# Altium schematic sheet Sensors.SchDoc
size A4
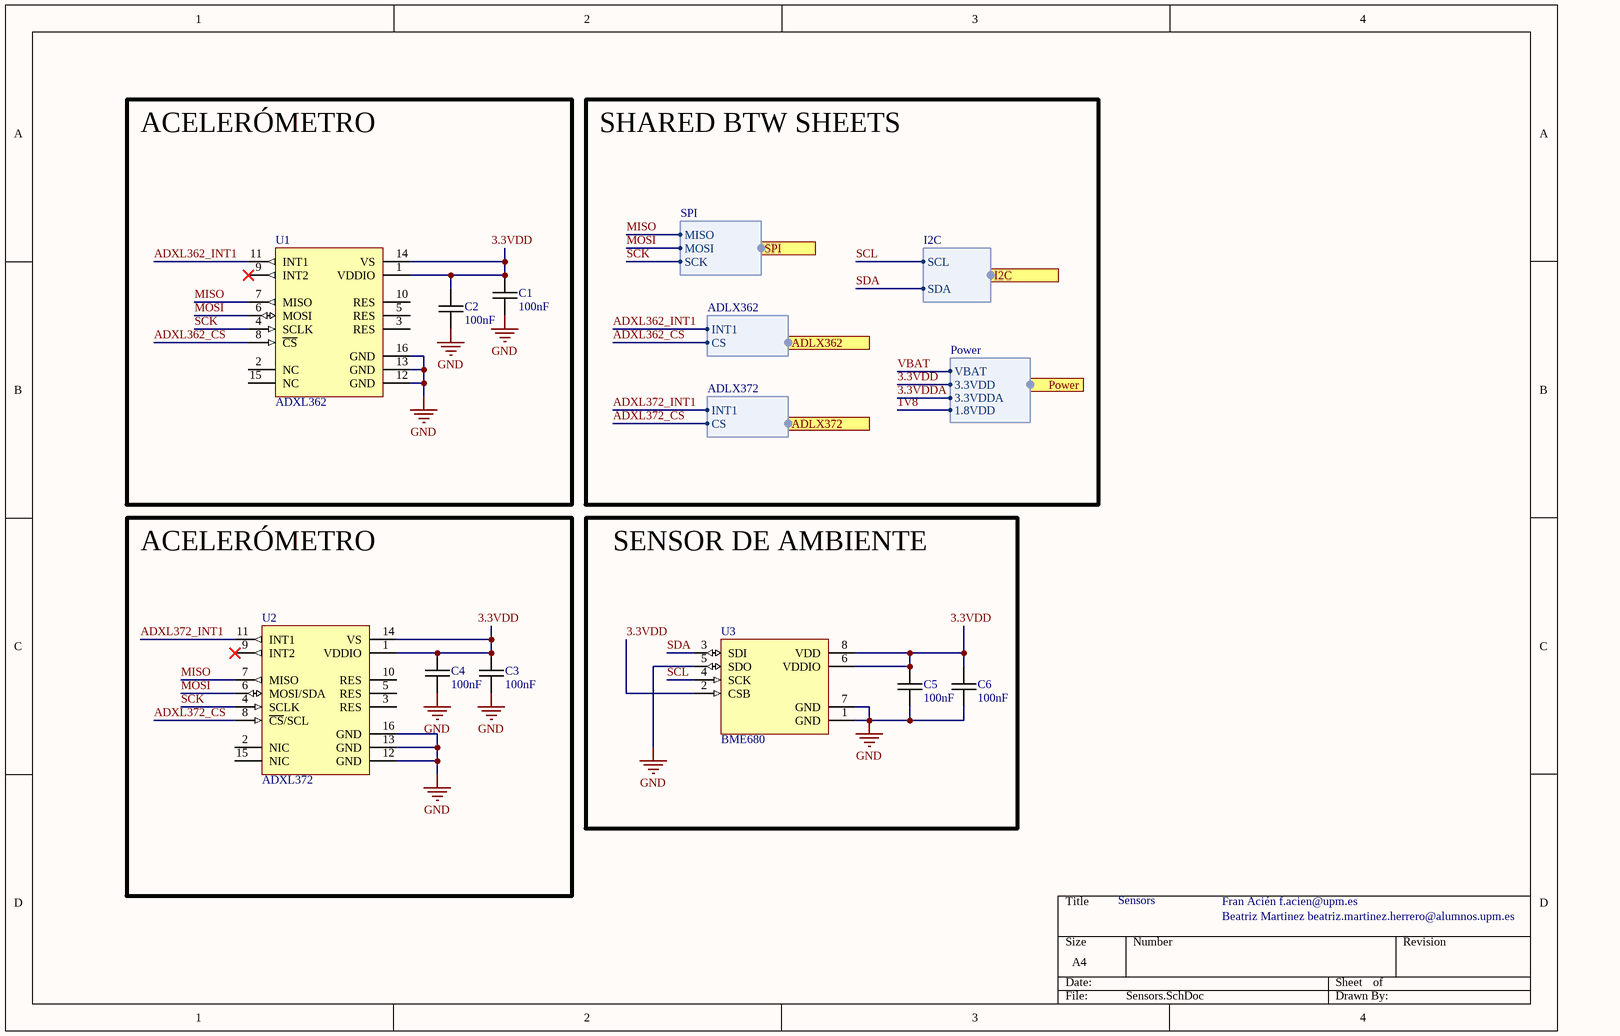
[diagram p0: Sensors.SchDoc]

## Parts
C1  100nF  [0603C-GENERIC]
C2  100nF  [0603C-GENERIC]
C3  100nF  [0603C-GENERIC]
C4  100nF  [0603C-GENERIC]
C5  100nF  [0603C-GENERIC]
C6  100nF  [0603C-GENERIC]
U1  ADXL362  [LGA50P322X300X114-16N]
U2  ADXL372  [LGA50P322X300X114-16N]
U3  BME680  [BME680]

## Blocks framed on the sheet
ACELERÓMETRO: C1 C2 U1
ACELERÓMETRO: C3 C4 U2
SENSOR DE AMBIENTE: C5 C6 U3

## Ports
ADLX362 (harness ADLX362), ADLX372 (harness ADLX372), I2C (harness I2C), Power (harness Power), SPI (harness SPI)

## Harnesses
ADLX372: INT1, CS
ADLX362: INT1, CS
Power: VBAT, 3.3VDD, 3.3VDDA, 1.8VDD
I2C: SCL, SDA
SPI: MISO, MOSI, SCK

## Nets
GND: C1.2 C2.2 C3.2 C4.2 C5.2 C6.2 U1.12(GND) U1.13(GND) U1.16(GND) U2.12(GND) U2.13(GND) U2.16(GND) U3.1(GND) U3.5(SDO) U3.7(GND)
1V8: port Power.1.8VDD
3.3VDD: U3.2(CSB) ; port Power.3.3VDD
3.3VDDA: port Power.3.3VDDA
ADXL362_CS: U1.8(~{CS}) ; port ADLX362.CS
ADXL362_INT1: U1.11(INT1) ; port ADLX362.INT1
ADXL372_CS: U2.8(~{CS}/SCL) ; port ADLX372.CS
ADXL372_INT1: U2.11(INT1) ; port ADLX372.INT1
MISO: U1.7(MISO) U2.7(MISO) ; port SPI.MISO
MOSI: U1.6(MOSI) U2.6(MOSI/SDA) ; port SPI.MOSI
SCK: U1.4(SCLK) U2.4(SCLK) ; port SPI.SCK
SCL: U3.4(SCK) ; port I2C.SCL
SDA: U3.3(SDI) ; port I2C.SDA
VBAT: port Power.VBAT
NetC1_1: C1.1 C2.1 U1.1(VDDIO) U1.14(VS)
NetC3_1: C3.1 C4.1 U2.1(VDDIO) U2.14(VS)
NetC5_1: C5.1 C6.1 U3.6(VDDIO) U3.8(VDD)

Not connected (* = marked no-connect by the designer): U1 2(NC) 3(RES) 5(RES) 9(INT2)* 10(RES) 15(NC); U2 2(NIC) 3(RES) 5(RES) 9(INT2)* 10(RES) 15(NIC)

## Notes on the sheet
- SHARED BTW SHEETS
- Sensors
- Fran Acién f.acien@upm.es
- Beatriz Martinez beatriz.martinez.herrero@alumnos.upm.es
- Labels drawn without touching a wire or pin: 3.3VDD

## Library data of the parts
C1-C6 = 0603C-100NF-50V-X7R-TDK: CAPACITOR 0603 CERAMIC; Manufacturer Part Number: C1608X7R1H103K; Manufacturer: TDK Corporation; Temperature Coefficient: X7R; Tolerance: ±10%; Voltage - Rated: 50V; Capacitance: 10000pF; Reel: C68; RoHS: RoHS Compliant; Lead Spacing: -; Package / Case: 0603 (1608 metric); Features: General Purpose; Packaging: Tape & Reel (TR); Thickness: 0.80mm; Operating Temperature: -55°C ~ 125°C; Mounting Type: Surface Mount, MLCC; Category: Capacitors; Supplier 1: Digi-Key; Supplier Part Number 1: 445-1314-2-ND
U1 = ADXL362: Micropower, 3-Axis, ±2 g/±4 g/±8 g Digital Output MEMS Accelerometer; Manufacturer: Analog Devices; Part number IPS: 00000001799; Artikkelnr Noca: N.A.; Part Number: ADXL362; Manufacturer Part Number: ADXL362; ComponentLink1URL: http://www.analog.com/media/en/technical-documentation/data-sheets/ADXL362.pdf; ComponentLink1Description: Datasheet; ComponentLink2URL: http://www.analog.com/en/products/adxl362.html; ComponentLink2Description: Supplier link; HelpURL: https://www.analog.com/media/en/technical-documentation/data-sheets/ADXL362.pdf; Footprint Doc: LGA-16; LatestRevisionDate: 2019-01-11; Pin Count: 16; Publisher: Nordic Semiconductor; Published: 2019-01-11; Value: ADXL362; Note: *; Supplier 1: Digi-Key; Supplier Part Number 1: ADXL362BCCZ-RL7CT-ND; Supplier 2: Mouser; Supplier Part Number 2: 584-ADXL362BCCZ-R7
U2 = ADXL372: Micropower, 3-Axis, ±200g digital output acelerometer; Manufacturer: Analog Devices; Part number IPS: 00000001798; Artikkelnr Noca: N.A.; Part Number: ADXL372; Manufacturer Part Number: ADXL372; Footprint Doc: LGA-16; LatestRevisionDate: 2018-08-24; Pin Count: 16; Publisher: Nordic Semiconductor; Published: 2018-08-24; Value: ADXL372; Note: *; ComponentLink1URL: http://www.analog.com/media/en/technical-documentation/data-sheets/ADXL372.pdf; ComponentLink1Description: Datasheet; ComponentLink2URL: http://www.analog.com/en/products/adxl372.html; ComponentLink2Description: Supplier link; HelpURL: http://www.analog.com/en/products/adxl372.html; Supplier 1: Digi-Key; Supplier Part Number 1: ADXL372BCCZ-RL7CT-ND; Supplier 2: *; Supplier Part Number 2: *
U3 = BME680: Low power gas, pressure, temperature & humidity sensor; Manufacturer: Bosch; Part number IPS: 00000001800; Artikkelnr Noca: N.A.; Part Number: BME680; Manufacturer Part Number: BME680; Footprint Doc: LGA-8; LatestRevisionDate: 2018-05-24; Pin Count: 8; Publisher: Nordic Semiconductor; Published: 2018-05-24; Value: BME680; Note: *; ComponentLink1URL: https://ae-bst.resource.bosch.com/media/_tech/media/datasheets/BST-BME680-DS001-00.pdf; ComponentLink1Description: Datasheet; ComponentLink2Description: Supplier link; HelpURL: *; Supplier 1: Digi-Key; Supplier Part Number 1: 828-1077-1-ND; Supplier 2: *; Supplier Part Number 2: *